# EAGLE design platine (EAGLE 6.6.0)
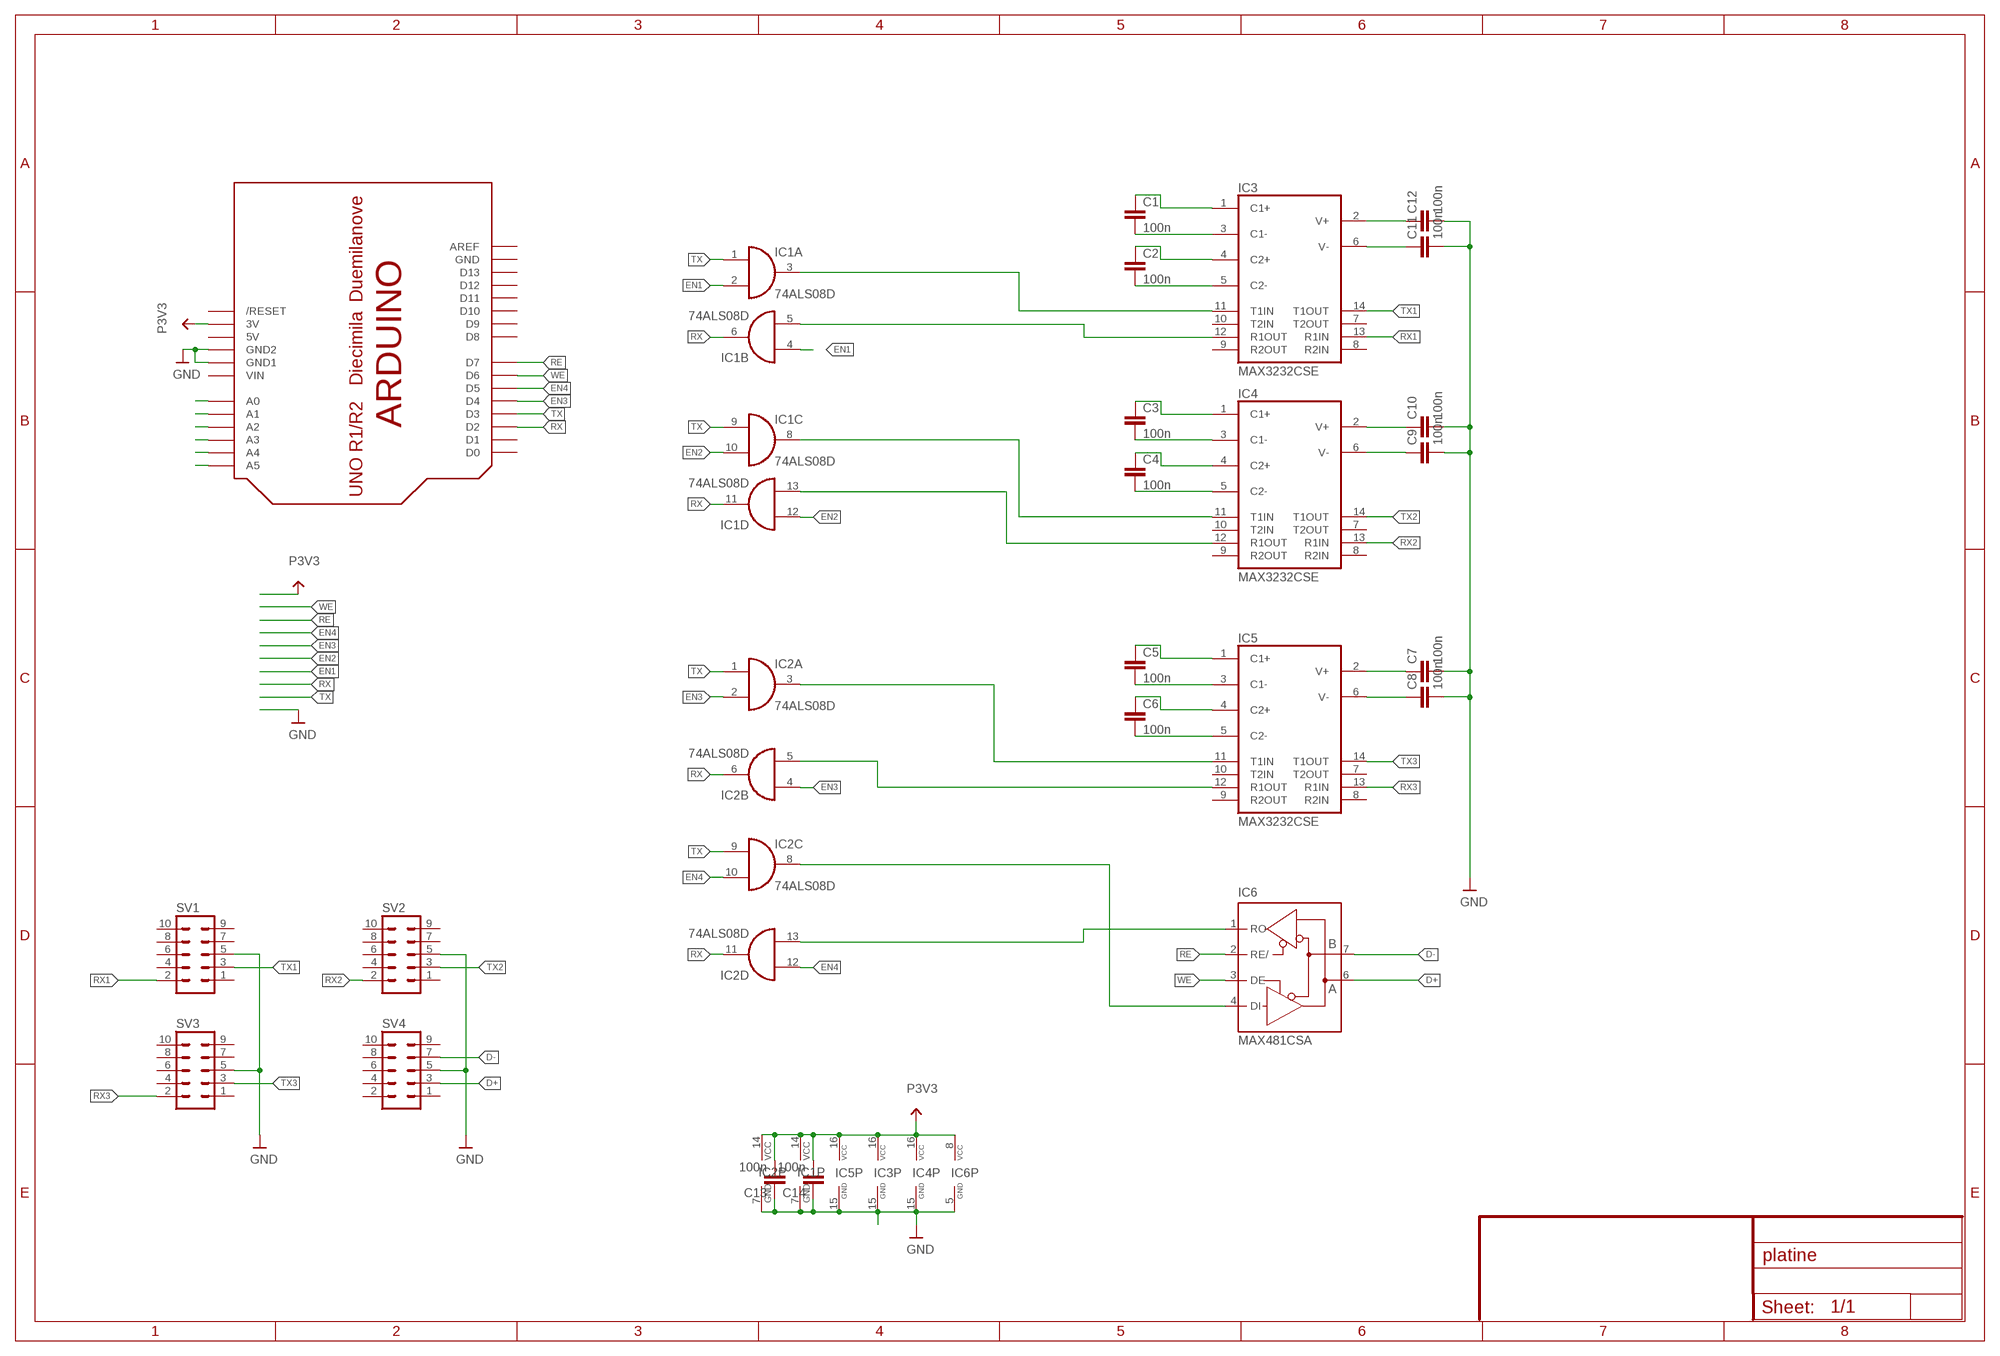
[diagram p0: schematic, sheet 1]

## Parts
C1  100n  C-EUC1210  [C1210]
C2  100n  C-EUC1210  [C1210]
C3  100n  C-EUC1210  [C1210]
C4  100n  C-EUC1210  [C1210]
C5  100n  C-EUC1210  [C1210]
C6  100n  C-EUC1210  [C1210]
C7  100n  C-EUC1210  [C1210]
C8  100n  C-EUC1210  [C1210]
C9  100n  C-EUC1210  [C1210]
C10  100n  C-EUC1210  [C1210]
C11  100n  C-EUC1210  [C1210]
C12  100n  C-EUC1210  [C1210]
C13  100n  C-EUC1210  [C1210]
C14  100n  C-EUC1210  [C1210]
IC1  74ALS08D  [SO14]
IC2  74ALS08D  [SO14]
IC3  MAX3232CSE  [SO16]
IC4  MAX3232CSE  [SO16]
IC5  MAX3232CSE  [SO16]
IC6  MAX481CSA  [SO08]
SV1  ML10  [ML10]
SV2  ML10  [ML10]
SV3  ML10  [ML10]
SV4  ML10  [ML10]
U$1  ARDUINO-NOHOLE  [ARDUINO-NOHOLE]

## Nets
D+: IC6.6(A) SV4.3
D-: IC6.7(B) SV4.7
EN1: IC1.2(A:I1) IC1.4(B:I0) U$1.A0
EN2: IC1.10(C:I1) IC1.12(D:I0) U$1.A1
EN3: IC2.2(A:I1) IC2.4(B:I0) U$1.D4
EN4: IC2.10(C:I1) IC2.12(D:I0) U$1.D5
GND: C7.2 C8.2 C9.2 C10.2 C11.2 C12.2 C13.1 C14.1 IC1.7(P:GND) IC2.7(P:GND) IC3.15(GND) IC4.15(GND) IC5.15(GND) IC6.5(GND) SV1.5 SV2.5 SV3.5 SV4.5 U$1.GND1 U$1.GND2
N$1: IC1.5(B:I1) IC3.12(R1OUT)
N$2: IC1.3(A:O) IC3.11(T1IN)
N$3: IC1.8(C:O) IC4.11(T1IN)
N$4: IC1.13(D:I1) IC4.12(R1OUT)
N$5: IC2.3(A:O) IC5.11(T1IN)
N$6: IC2.5(B:I1) IC5.12(R1OUT)
N$7: IC2.8(C:O) IC6.4(DI)
N$8: IC2.13(D:I1) IC6.1(RO)
N$9: C6.2 IC5.5(C2-)
N$10: C6.1 IC5.4(C2+)
N$11: C5.2 IC5.3(C1-)
N$12: C5.1 IC5.1(C1+)
N$13: C4.2 IC4.5(C2-)
N$14: C4.1 IC4.4(C2+)
N$15: C3.1 IC4.1(C1+)
N$16: C3.2 IC4.3(C1-)
N$17: C2.2 IC3.5(C2-)
N$18: C2.1 IC3.4(C2+)
N$19: C1.2 IC3.3(C1-)
N$20: C1.1 IC3.1(C1+)
N$21: C12.1 IC3.2(V+)
N$22: C11.1 IC3.6(V-)
N$23: C7.1 IC5.2(V+)
N$24: C8.1 IC5.6(V-)
N$25: C10.1 IC4.2(V+)
N$26: C9.1 IC4.6(V-)
N$27: U$1.A5
N$28: U$1.A4
N$29: U$1.A3
N$30: U$1.A2
P3V3: C13.2 C14.2 IC1.14(P:VCC) IC2.14(P:VCC) IC3.16(VCC) IC4.16(VCC) IC5.16(VCC) IC6.8(VCC) U$1.3V
RE: IC6.2(RE/) U$1.D7
RX: IC1.6(B:O) IC1.11(D:O) IC2.6(B:O) IC2.11(D:O) U$1.D2
RX1: IC3.13(R1IN) SV1.2
RX2: IC4.13(R1IN) SV2.2
RX3: IC5.13(R1IN) SV3.2
TX: IC1.1(A:I0) IC1.9(C:I0) IC2.1(A:I0) IC2.9(C:I0) U$1.D3
TX1: IC3.14(T1OUT) SV1.3
TX2: IC4.14(T1OUT) SV2.3
TX3: IC5.14(T1OUT) SV3.3
WE: IC6.3(DE) U$1.D6
Unconnected: IC3.7(T2OUT) IC3.8(R2IN) IC3.9(R2OUT) IC3.10(T2IN) IC4.7(T2OUT) IC4.8(R2IN) IC4.9(R2OUT) IC4.10(T2IN) IC5.7(T2OUT) IC5.8(R2IN) IC5.9(R2OUT) IC5.10(T2IN) SV1.1 SV1.4 SV1.6 SV1.7 SV1.8 SV1.9 SV1.10 SV2.1 SV2.4 SV2.6 SV2.7 SV2.8 SV2.9 SV2.10 SV3.1 SV3.4 SV3.6 SV3.7 SV3.8 SV3.9 SV3.10 SV4.1 SV4.2 SV4.4 SV4.6 SV4.8 SV4.9 SV4.10 U$1.AREF U$1.D0 U$1.D1 U$1.D8 U$1.D9 U$1.D10 U$1.D11 U$1.D12 U$1.D13 U$1.RESET(/RESET)

## Power pins joined to a net without a drawn wire
5V: U$1.5V
GND: U$1.GND
VIN: U$1.VIN

## Library data of the parts
C1-C14 = schlager_passiv:C-EU: CAPACITOR, European symbol
IC1 IC2 = 74xx-eu:74*08: Quad 2-input AND gate
IC3-IC5 = schlager_ics:MAX3232*: True RS-232 Transceivers 3.0V to 5.5V, Low-Power up to 1Mbps, Using Four 0.1µF External Capacitors Source: http://pdfserv.maxim-ic.com/en/ds/MAX3222-MAX3241.pdf; MPN: MAX3232CSE; OC_FARNELL: 9725490; OC_NEWARK: 90C2890
IC6 = schlager_ics:MAX481CSA: RS485 TRANSEIVER; MPN: MAX481CSA+; OC_FARNELL: 2113664; OC_NEWARK: 90C3817; OC_REICHELT: MAX 481 CSA
SV1-SV4 = X_Pfostenstecker:ML10: HARTING; OC_FARNELL: unknown; OC_NEWARK: unknown
U$1 = adafruit:ARDUINO: Arduino Diecimila/Duemilanove Make a shield with ease, this package has all the named pins as well as the two mounting drill holes and an outline of the USB and DC power connector. The outline is on the DIMENSION layer, so if your board house uses it they will cut the outline to match. http://www.ladyada.net/library/pcb/eaglelibrary.html

## Net classes
0 default: width 0.203 mm, drill 0.203 mm, clearance 0.178 mm
2 gnd: width 0.254 mm, drill 0.254 mm, clearance 0.178 mm
3 usbvcc: width 0.203 mm, drill 0.406 mm, clearance 0.178 mm
4 USBpair: width 0.254 mm, drill 0.406 mm, clearance 0.508 mm

## Board
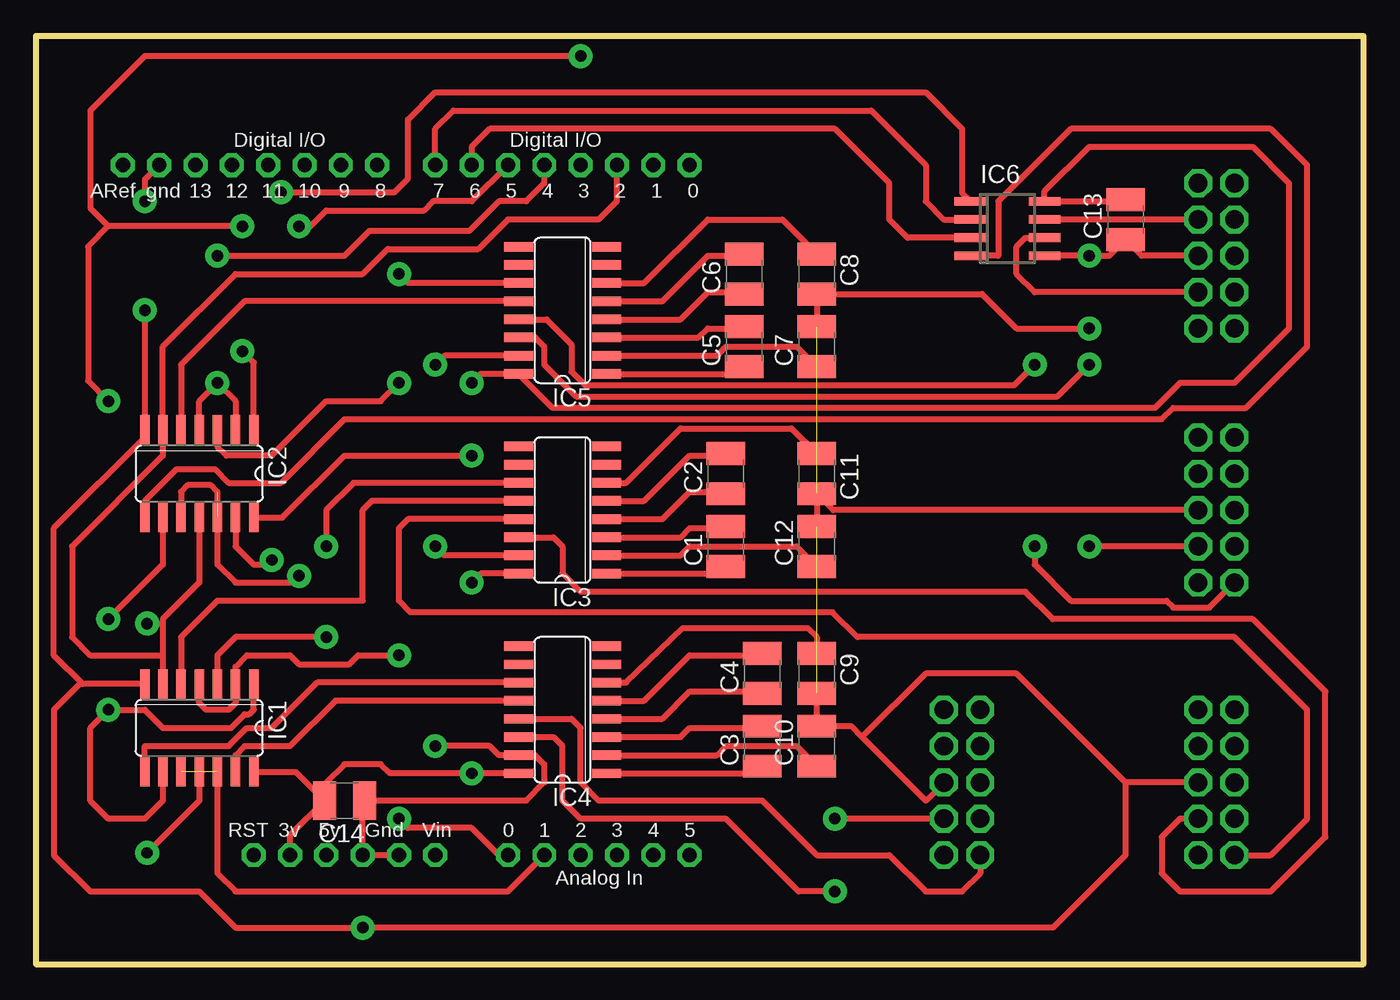
[diagram p1: board, top side]
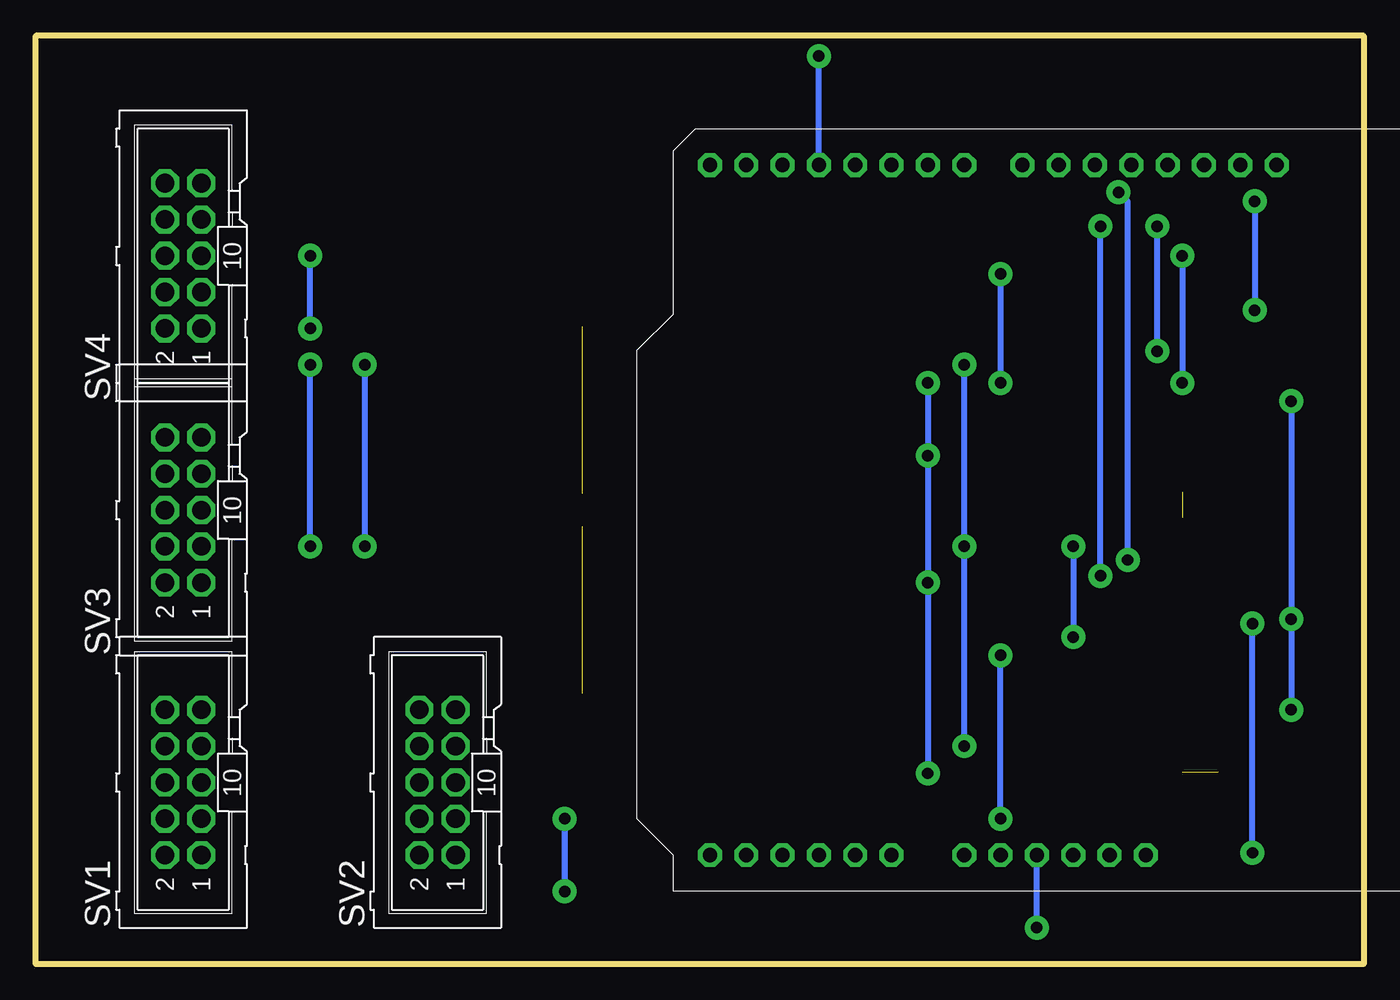
[diagram p2: board, bottom side, seen from below]

Size 92.86 x 64.92 mm. Coordinates in mm from the lower left corner, seen from the top.
Outline: 0,0 92.86,0 92.86,64.92 0,64.92 0,0
Copper layers (1*16): Top 0.035mm / dielectric 1.5mm / Bottom 0.035mm
Design rules "ITEADstudio_DRC": minimum track width 6mil, minimum drill 12mil, track to track 6mil, track to pad 6mil, pad to pad 6mil, via to via 6mil, smd to smd 0mil, copper to edge 10mil, drill to drill 10mil, minimum pad ring 10mil, minimum via ring 6mil, stop-mask expansion 2mil, vias tented up to drill 100mil, thermal gap 10mil

### Footprints (pad centres in the part's own frame; a part is rotated, then mirrored left to right if it is on the bottom)
C1210 = smd 1.6 x 2.7: 1 -1.4,0; 2 1.4,0
SO14 = smd 0.66 x 2.032: 1 -3.81,-3.073; 2 -2.54,-3.073; 3 -1.27,-3.073; 4 0,-3.073; 5 1.27,-3.073; 6 2.54,-3.073; 7 3.81,-3.073; 8 3.81,3.073; 9 2.54,3.073; 10 1.27,3.073; 11 0,3.073; 12 -1.27,3.073; 13 -2.54,3.073; 14 -3.81,3.073
SO16 = smd 0.66 x 2.032: 1 -4.445,-3.073; 2 -3.175,-3.073; 3 -1.905,-3.073; 4 -0.635,-3.073; 5 0.635,-3.073; 6 1.905,-3.073; 7 3.175,-3.073; 8 4.445,-3.073; 9 4.445,3.073; 10 3.175,3.073; 11 1.905,3.073; 12 0.635,3.073; 13 -0.635,3.073; 14 -1.905,3.073; 15 -3.175,3.073; 16 -4.445,3.073
SO08 = smd 0.6 x 2.2: 1 -1.905,-2.6; 2 -0.635,-2.6; 3 0.635,-2.6; 4 1.905,-2.6; 5 1.905,2.6; 6 0.635,2.6; 7 -0.635,2.6; 8 -1.905,2.6
ML10 = drill 1.3 octagon: 1 -5.08,-1.27; 2 -5.08,1.27; 3 -2.54,-1.27; 4 -2.54,1.27; 5 0,-1.27; 6 0,1.27; 7 2.54,-1.27; 8 2.54,1.27; 9 5.08,-1.27; 10 5.08,1.27
ARDUINO-NOHOLE = drill 1 pad 1.676 octagon: 3V 35.56,2.54; 5V 38.1,2.54; A0 50.8,2.54; A1 53.34,2.54; A2 55.88,2.54; A3 58.42,2.54; A4 60.96,2.54; A5 63.5,2.54; AREF 23.876,50.8; D0 63.5,50.8; D1 60.96,50.8; D2 58.42,50.8; D3 55.88,50.8; D4 53.34,50.8; D5 50.8,50.8; D6 48.26,50.8; D7 45.72,50.8; D8 41.656,50.8; D9 39.116,50.8; D10 36.576,50.8; D11 34.036,50.8; D12 31.496,50.8; D13 28.956,50.8; GND 26.416,50.8; GND1 43.18,2.54; GND2 40.64,2.54; RESET 33.02,2.54; VIN 45.72,2.54

### Placement (x,y rotation side)
C1  48.26,29.21 90 top
C2  48.26,34.29 90 top
C3  50.8,15.24 90 top
C4  50.8,20.32 90 top
C5  49.53,43.18 90 top
C6  49.53,48.26 90 top
C7  54.61,43.18 90 top
C8  54.61,48.26 270 top
C9  54.61,20.32 270 top
C10  54.61,15.24 90 top
C11  54.61,34.29 270 top
C12  54.61,29.21 90 top
C13  76.2,52.07 90 top
C14  21.59,11.43 180 top
IC1  11.43,16.51 180 top
IC2  11.43,34.29 180 top
IC3  36.83,31.75 90 top
IC4  36.83,17.78 90 top
IC5  36.83,45.72 90 top
IC6  67.94,51.44 270 top
SV1  82.55,12.7 90 bottom
SV2  64.77,12.7 90 bottom
SV3  82.55,31.75 90 bottom
SV4  82.55,49.53 90 bottom
U$1  -17.78,5.08 0 top

### Tracks (layer width: path | path; a pad name or v marks a point on that pad's centre or on a via)
D+
  Top 0.406: SV4.3 69.85,46.99 68.58,48.26 68.58,50.16 69.22,50.8 IC6.6
D-
  Top 0.406: SV4.7 IC6.7
EN1  (via drill 0.8 pad 1.68)
  Top 0.406: IC1.4 11.43,18.26 11.91,17.78 13.49,17.78 13.97,18.26 IC1.2 13.97,20.8 14.76,21.59 17.78,21.59 18.41,20.95 21.91,20.95 22.54,21.59 v25.4,21.59 | U$1.A0 32.38,7.62 30.48,9.53 26.04,9.53 v25.4,10.16
  Bottom 0.406: v25.4,10.16 v25.4,21.59
EN2  (1 unrouted)
  Top 0.406: IC1.12 12.7,6.35 13.97,5.08 33.02,5.08 U$1.A1
EN3  (via drill 0.8 pad 1.68)
  Top 0.406: IC2.4 11.43,39.37 v12.7,40.64 13.97,39.37 IC2.2 | U$1.D4 35.56,54.61 34.29,53.34 32.38,53.34 30.32,51.28 23.34,51.28 21.59,49.53 v12.7,49.53
  Bottom 0.406: v12.7,49.53 v12.7,40.64
EN4  (via drill 0.8 pad 1.68)  (1 unrouted)
  Top 0.406: IC2.10 10.16,33.02 10.64,33.5 12.22,33.5 12.7,33.02 12.7,27.94 13.97,26.67 17.94,26.67 v18.41,27.15 | U$1.D5 30.48,53.34 27.78,53.34 27.15,52.7 20.32,52.7 19.21,51.59 v18.41,51.59
  Bottom 0.406: v18.41,27.15 v18.41,51.59
GND  (via drill 0.8 pad 1.68)  (2 unrouted)
  Top 0.406: C9.2 C10.2 57.02,16.64 57.78,15.88 | C7.2 C8.2 66.17,46.86 68.58,44.45 v73.66,44.45 | U$1.GND1 U$1.GND2 22.86,11.3 C14.1 34.29,11.43 35.56,12.7 35.56,13.97 34.92,14.61 IC4.15 32.38,14.61 31.75,15.24 v27.94,15.24 | SV4.5 77.34,49.53 C13.1 75.06,49.53 v73.66,49.53 IC6.5 | U$1.GND 7.62,54.86 v7.62,53.34 | IC3.15 28.57,28.57 v27.94,29.21 | IC5.15 28.57,42.55 v27.94,41.91 | SV2.5 62.23,11.43 57.78,15.88 | 76.2,12.7 68.58,20.32 62.23,20.32 57.78,15.88 | SV3.5 55.75,31.75 C11.2 C12.2 | 76.2,12.7 76.2,7.62 71.12,2.54 v22.86,2.54 13.97,2.54 11.43,5.08 3.81,5.08 1.27,7.62 1.27,17.78 3.07,19.58 IC1.7 3.28,19.58 1.27,21.59 1.27,30.48 7.62,36.83 IC2.7 v7.62,45.72 | SV1.5 76.2,12.7
  Bottom 0.406: v27.94,15.24 v27.94,29.21 v27.94,41.91 | v22.86,2.54 U$1.GND2 | v73.66,44.45 v73.66,49.53 | v7.62,53.34 v7.62,45.72
N$1
  Top 0.406: IC3.12 23.5,32.38 22.86,31.75 22.86,25.4 12.7,25.4 10.16,22.86 IC1.5
N$2  (via drill 0.8 pad 1.68)
  Top 0.406: IC3.11 22.23,33.66 20.32,31.75 v20.32,29.21 | v20.32,22.86 13.97,22.86 12.7,21.59 IC1.3
  Bottom 0.406: v20.32,29.21 v20.32,22.86
N$3
  Top 0.406: IC4.11 19.68,19.68 16.51,16.51 14.76,16.51 13.49,15.24 7.62,15.24 IC1.8
N$4
  Top 0.406: IC4.12 20.95,18.41 17.78,15.24 14.61,15.24 13.97,14.61 IC1.13
N$5  (via drill 0.8 pad 1.68)
  Top 0.406: IC2.3 12.7,36.2 13.34,35.56 16.51,35.56 20.32,39.37 24.13,39.37 v25.4,40.64 | IC5.11 26.04,47.62 v25.4,48.26
  Bottom 0.406: v25.4,48.26 v25.4,40.64
N$6
  Top 0.406: IC5.12 14.61,46.35 10.16,41.91 IC2.5
N$7
  Top 0.406: IC2.8 7.62,32.38 9.84,34.61 12.54,34.61 13.49,33.66 17.14,33.66 21.59,38.1 78.74,38.1 79.53,38.89 84.61,38.89 88.9,43.18 88.9,55.88 86.36,58.42 72.39,58.42 67.31,53.34 67.31,49.53 IC6.4
N$8  (via drill 0.8 pad 1.68)
  Top 0.406: IC2.13 13.97,29.21 15.24,27.94 16.19,27.94 v16.51,28.26 | v17.14,53.98 25.08,53.98 26.04,54.93 26.04,59.05 27.94,60.96 62.23,60.96 64.77,58.42 64.77,53.91 IC6.1
  Bottom 0.406: v16.51,28.26 16.51,53.34 v17.14,53.98
N$9
  Top 0.406: IC5.5 43.81,46.35 46.99,49.53 50.67,49.53 C6.2
N$10
  Top 0.406: IC5.4 45.09,45.09 46.99,46.99 50.67,46.99 C6.1
N$11
  Top 0.406: IC5.3 46.35,43.81 46.99,44.45 50.67,44.45 C5.2
N$12
  Top 0.406: IC5.1 50.3,41.27 C5.1
N$13
  Top 0.406: IC4.5 42.55,18.41 45.72,21.59 50.67,21.59 C4.2
N$14
  Top 0.406: IC4.4 43.81,17.14 45.72,19.05 50.67,19.05 C4.1
N$15
  Top 0.406: IC4.1 50.3,13.34 C3.1
N$16
  Top 0.406: IC4.3 45.09,15.88 45.72,16.51 50.67,16.51 C3.2
N$17
  Top 0.406: IC3.5 42.55,32.38 45.72,35.56 48.13,35.56 C2.2
N$18
  Top 0.406: IC3.4 43.81,31.11 45.72,33.02 46.86,33.02 C2.1
N$19
  Top 0.406: IC3.3 45.09,29.84 45.72,30.48 49.4,30.48 C1.2
N$20
  Top 0.406: IC3.1 47.76,27.3 C1.1
N$21
  Top 0.406: IC3.2 45.09,28.57 45.72,29.21 53.21,29.21 C12.1
N$22
  Top 0.406: IC3.6 41.27,33.66 45.09,37.47 52.84,37.47 C11.1
N$23
  Top 0.406: IC5.2 47.62,42.55 48.26,43.18 53.21,43.18 C7.1
N$24
  Top 0.406: IC5.6 42.55,47.62 46.99,52.07 52.2,52.07 C8.1
N$25
  Top 0.406: IC4.2 47.62,14.61 48.26,15.24 53.21,15.24 C10.1
N$26
  Top 0.406: IC4.6 41.27,19.68 45.24,23.5 53.98,23.5 54.61,22.86 C9.1
P3V3  (via drill 0.8 pad 1.68)
  Top 0.406: U$1.3V 17.78,9.02 C14.2 | IC4.16 v30.48,13.34 24.77,13.34 24.13,13.97 21.59,13.97 20.32,12.7 20.32,11.56 C14.2 | IC1.14 18.18,13.44 C14.2 | IC3.16 31.11,27.3 v30.48,26.67 | C13.2 76.07,53.34 IC6.8 70.55,54.03 73.66,57.15 85.09,57.15 87.63,54.61 87.63,44.45 83.82,40.64 80.01,40.64 78.26,38.89 36.14,38.89 IC5.16 31.11,41.27 v30.48,40.64 | IC2.14 17.25,31.22 21.59,35.56 v30.48,35.56
  Bottom 0.406: v30.48,13.34 v30.48,26.67 v30.48,35.56 v30.48,40.64
RE
  Top 0.406: U$1.D7 27.94,58.42 29.21,59.69 58.42,59.69 62.23,55.88 62.23,53.34 63.5,52.07 IC6.2
RX  (via drill 0.8 pad 1.68)
  Top 0.406: IC1.11 11.43,11.43 v7.78,7.78 | IC2.11 11.43,26.67 8.89,24.13 8.89,23.81 | 8.89,23.81 8.89,21.59 | 8.89,21.59 IC1.6 | v7.78,23.81 8.89,23.81 | U$1.D2 40.64,53.34 39.37,52.07 33.02,52.07 30.96,50.01 24.61,50.01 22.86,48.26 13.97,48.26 8.89,43.18 IC2.6 8.89,35.56 2.54,29.21 2.54,22.86 3.81,21.59 8.89,21.59
  Bottom 0.406: v7.78,7.78 v7.78,23.81
RX1
  Top 0.406: SV1.2 86.36,7.62 88.9,10.16 88.9,17.78 83.82,22.86 57.47,22.86 55.72,24.61 26.19,24.61 25.4,25.4 25.4,30.48 26.04,31.11 IC3.13
RX2
  Top 0.406: IC4.13 37.47,17.14 38.1,16.51 38.1,12.7 39.37,11.43 50.8,11.43 54.61,7.62 59.69,7.62 62.23,5.08 64.77,5.08 66.04,6.35 SV2.2
RX3  (via drill 0.8 pad 1.68)
  Top 0.406: IC5.13 35.72,45.09 37.47,43.34 37.47,41.43 38.42,40.48 68.42,40.48 v69.85,41.91 | v69.85,29.21 69.85,27.94 72.39,25.4 79.06,25.4 79.53,24.92 82.07,24.92 SV3.2
  Bottom 0.406: v69.85,41.91 v69.85,29.21
TX  (via drill 0.8 pad 1.68)
  Top 0.406: IC1.9 8.89,11.43 7.62,10.16 5.08,10.16 3.81,11.43 3.81,16.51 v5.08,17.78 7.62,17.78 8.89,16.51 13.65,16.51 14.61,17.46 14.92,17.46 15.24,17.78 IC1.1 | IC2.9 8.89,27.94 v5.08,24.13 | IC2.1 15.24,42.07 v14.45,42.86 | v14.45,51.59 5.08,51.59 | 5.08,51.59 3.65,50.16 3.65,40.8 v5.08,39.37 | v38.1,63.5 7.62,63.5 3.81,59.69 3.81,52.86 5.08,51.59
  Bottom 0.406: v5.08,17.78 v5.08,24.13 v5.08,39.37 | v14.45,42.86 v14.45,51.59 | U$1.D3 v38.1,63.5
TX1
  Top 0.406: SV1.3 80.01,10.16 78.74,8.89 78.74,6.35 80.01,5.08 86.36,5.08 90.17,8.89 90.17,19.05 85.09,24.13 71.12,24.13 69.22,26.04 38.1,26.04 36.83,27.3 36.83,29.21 36.2,29.84 IC3.14
TX2  (via drill 0.8 pad 1.68)
  Top 0.406: SV2.3 v55.88,10.16 | IC4.14 36.2,15.88 36.83,15.24 36.83,11.43 38.1,10.16 48.26,10.16 53.34,5.08 v55.88,5.08
  Bottom 0.406: v55.88,10.16 v55.88,5.08
TX3  (via drill 0.8 pad 1.68)
  Top 0.406: IC5.14 34.92,43.81 35.56,43.18 35.56,41.91 37.78,39.69 71.44,39.69 v73.66,41.91 | SV3.3 v73.66,29.21
  Bottom 0.406: v73.66,29.21 v73.66,41.91
WE
  Top 0.406: IC6.3 60.96,50.8 59.69,52.07 59.69,54.61 55.88,58.42 31.75,58.42 30.48,57.15 U$1.D6

### Text on the board
_tNames: R5 | R3